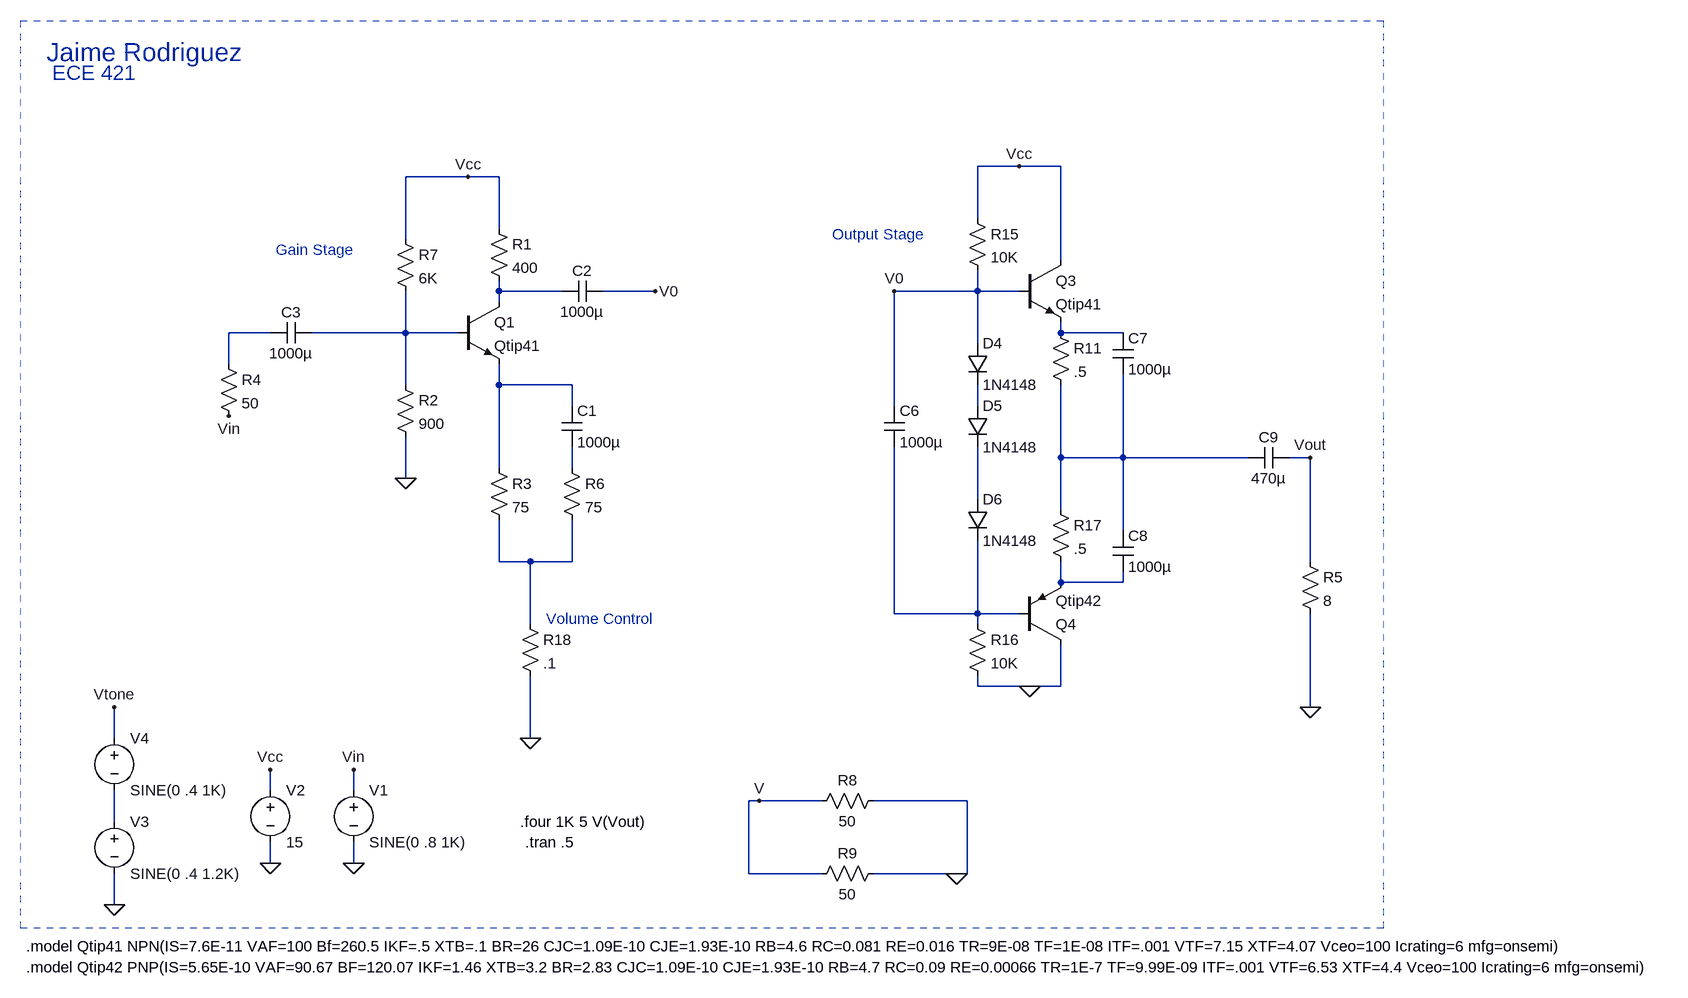
[diagram p0: schematic scrap copy.asc]
scrap copy.asc, the LTspice schematic file:
Version 4
SHEET 1 3016 1444
WIRE 1600 192 1536 192
WIRE 1664 192 1600 192
WIRE 752 208 656 208
WIRE 800 208 752 208
WIRE 1536 272 1536 192
WIRE 800 288 800 208
WIRE 656 304 656 208
WIRE 1664 336 1664 192
WIRE 800 384 800 368
WIRE 896 384 800 384
WIRE 1040 384 960 384
WIRE 1536 384 1536 352
WIRE 1536 384 1408 384
WIRE 1600 384 1536 384
WIRE 800 400 800 384
WIRE 448 448 384 448
WIRE 656 448 656 384
WIRE 656 448 512 448
WIRE 736 448 656 448
WIRE 1664 448 1664 432
WIRE 1760 448 1664 448
WIRE 1536 464 1536 384
WIRE 384 496 384 448
WIRE 656 528 656 448
WIRE 800 528 800 496
WIRE 912 528 800 528
WIRE 912 560 912 528
WIRE 1408 560 1408 384
WIRE 1536 560 1536 528
WIRE 1664 640 1664 528
WIRE 1760 640 1760 512
WIRE 1760 640 1664 640
WIRE 1952 640 1760 640
WIRE 2048 640 2016 640
WIRE 800 656 800 528
WIRE 912 656 912 624
WIRE 656 672 656 608
WIRE 1536 704 1536 624
WIRE 1664 720 1664 640
WIRE 1760 752 1760 640
WIRE 800 800 800 736
WIRE 848 800 800 800
WIRE 912 800 912 736
WIRE 912 800 848 800
WIRE 2048 800 2048 640
WIRE 1664 832 1664 800
WIRE 1760 832 1760 816
WIRE 1760 832 1664 832
WIRE 1408 880 1408 624
WIRE 1536 880 1536 768
WIRE 1536 880 1408 880
WIRE 1600 880 1536 880
WIRE 848 896 848 800
WIRE 1536 896 1536 880
WIRE 1536 992 1536 976
WIRE 1616 992 1536 992
WIRE 1664 992 1664 928
WIRE 1664 992 1616 992
WIRE 2048 1024 2048 880
WIRE 208 1072 208 1024
WIRE 848 1072 848 976
WIRE 448 1152 448 1120
WIRE 576 1152 576 1120
WIRE 1200 1168 1184 1168
WIRE 1296 1168 1200 1168
WIRE 1520 1168 1376 1168
WIRE 208 1200 208 1152
WIRE 448 1264 448 1232
WIRE 576 1264 576 1232
WIRE 1184 1280 1184 1168
WIRE 1296 1280 1184 1280
WIRE 1504 1280 1376 1280
WIRE 1520 1280 1520 1168
WIRE 1520 1280 1504 1280
WIRE 208 1328 208 1280
FLAG 576 1264 0
FLAG 448 1264 0
FLAG 448 1120 Vcc
FLAG 752 208 Vcc
FLAG 656 672 0
FLAG 1616 992 0
FLAG 1040 384 V0
FLAG 1408 384 V0
FLAG 2048 1024 0
FLAG 848 1072 0
FLAG 384 576 Vin
FLAG 576 1120 Vin
FLAG 208 1328 0
FLAG 208 1024 Vtone
FLAG 2048 640 Vout
FLAG 1504 1280 0
FLAG 1200 1168 V
FLAG 1600 192 Vcc
SYMBOL res 784 272 R0
SYMATTR InstName R1
SYMATTR Value 400
SYMBOL res 784 640 R0
SYMATTR InstName R3
SYMATTR Value 75
SYMBOL res 640 512 R0
SYMATTR InstName R2
SYMATTR Value 900
SYMBOL cap 896 560 R0
SYMATTR InstName C1
SYMATTR Value 1000µ
SYMBOL cap 960 368 R90
WINDOW 0 0 32 VBottom 2
WINDOW 3 32 32 VTop 2
SYMATTR InstName C2
SYMATTR Value 1000µ
SYMBOL cap 512 432 R90
WINDOW 0 0 32 VBottom 2
WINDOW 3 32 32 VTop 2
SYMATTR InstName C3
SYMATTR Value 1000µ
SYMBOL res 368 480 R0
SYMATTR InstName R4
SYMATTR Value 50
SYMBOL voltage 576 1136 R0
SYMATTR InstName V1
SYMATTR Value SINE(0 .8 1K)
SYMATTR Value2 AC 1
SYMBOL voltage 448 1136 R0
SYMATTR InstName V2
SYMATTR Value 15
SYMBOL res 640 288 R0
SYMATTR InstName R7
SYMATTR Value 6K
SYMBOL npn 736 400 R0
SYMATTR InstName Q1
SYMATTR Value Qtip41
SYMBOL res 896 640 R0
SYMATTR InstName R6
SYMATTR Value 75
SYMBOL npn 1600 336 R0
SYMATTR InstName Q3
SYMATTR Value Qtip41
SYMBOL pnp 1600 928 M180
SYMATTR InstName Q4
SYMATTR Value Qtip42
SYMBOL res 1648 432 R0
SYMATTR InstName R11
SYMATTR Value .5
SYMBOL res 1520 256 R0
SYMATTR InstName R15
SYMATTR Value 10K
SYMBOL res 1520 880 R0
SYMATTR InstName R16
SYMATTR Value 10K
SYMBOL res 1648 704 R0
SYMATTR InstName R17
SYMATTR Value .5
SYMBOL cap 1392 560 R0
SYMATTR InstName C6
SYMATTR Value 1000µ
SYMBOL cap 1744 448 R0
SYMATTR InstName C7
SYMATTR Value 1000µ
SYMBOL cap 1744 752 R0
SYMATTR InstName C8
SYMATTR Value 1000µ
SYMBOL cap 2016 624 R90
WINDOW 0 0 32 VBottom 2
WINDOW 3 32 32 VTop 2
SYMATTR InstName C9
SYMATTR Value 470µ
SYMBOL res 2032 784 R0
SYMATTR InstName R5
SYMATTR Value 8
SYMBOL res 832 880 R0
SYMATTR InstName R18
SYMATTR Value .1
SYMBOL diode 1520 464 R0
SYMATTR InstName D4
SYMATTR Value 1N4148
SYMBOL diode 1520 560 R0
SYMATTR InstName D5
SYMATTR Value 1N4148
SYMBOL diode 1520 704 R0
SYMATTR InstName D6
SYMATTR Value 1N4148
SYMBOL voltage 208 1184 R0
SYMATTR InstName V3
SYMATTR Value SINE(0 .4 1.2K)
SYMBOL voltage 208 1056 R0
SYMATTR InstName V4
SYMATTR Value SINE(0 .4 1K)
SYMBOL res 1392 1152 R90
WINDOW 0 0 56 VBottom 2
WINDOW 3 32 56 VTop 2
SYMATTR InstName R8
SYMATTR Value 50
SYMBOL res 1392 1264 R90
WINDOW 0 0 56 VBottom 2
WINDOW 3 32 56 VTop 2
SYMATTR InstName R9
SYMATTR Value 50
TEXT 840 1232 Left 2 !.tran .5
TEXT 72 1392 Left 2 !.model Qtip41 NPN(IS=7.6E-11 VAF=100 Bf=260.5 IKF=.5 XTB=.1 BR=26 CJC=1.09E-10 CJE=1.93E-10 RB=4.6 RC=0.081 RE=0.016 TR=9E-08 TF=1E-08 ITF=.001 VTF=7.15 XTF=4.07 Vceo=100 Icrating=6 mfg=onsemi)
TEXT 72 1424 Left 2 !.model Qtip42 PNP(IS=5.65E-10 VAF=90.67 BF=120.07 IKF=1.46 XTB=3.2 BR=2.83 CJC=1.09E-10 CJE=1.93E-10 RB=4.7 RC=0.09 RE=0.00066 TR=1E-7 TF=9.99E-09 ITF=.001 VTF=6.53 XTF=4.4 Vceo=100 Icrating=6 mfg=onsemi)
TEXT 104 16 Left 4 ;Jaime Rodriguez
TEXT 112 48 Left 3 ;ECE 421
TEXT 872 888 Left 2 ;Volume Control
TEXT 456 320 Left 2 ;Gain Stage
TEXT 1312 296 Left 2 ;Output Stage
TEXT 832 1200 Left 2 !.four 1K 5 V(Vout)
RECTANGLE Normal 64 -32 2160 1364 2

The netlist it stands for:
* scrap copy.asc
R1 Vcc N001 400
R3 N005 N010 75
R2 N003 0 900
C1 N005 N008 1000µ
C2 V0 N001 1000µ
C3 N003 N002 1000µ
R4 N002 Vin 50
V1 Vin 0 SINE(0 .8 1K) AC 1
V2 Vcc 0 15
R7 Vcc N003 6K
Q1 N001 N003 N005 0 Qtip41
R6 N008 N010 75
Q3 Vcc V0 N004 0 Qtip41
Q4 0 N012 N011 0 Qtip42
R11 N004 N007 .5
R15 Vcc V0 10K
R16 N012 0 10K
R17 N007 N011 .5
C6 V0 N012 1000µ
C7 N004 N007 1000µ
C8 N007 N011 1000µ
C9 Vout N007 470µ
R5 Vout 0 8
R18 N010 0 .1
D4 V0 N006 1N4148
D5 N006 N009 1N4148
D6 N009 N012 1N4148
V3 N013 0 SINE(0 .4 1.2K)
V4 Vtone N013 SINE(0 .4 1K)
R8 0 V 50
R9 0 V 50
.model D D
.lib standard.dio
.model NPN NPN
.model PNP PNP
.lib standard.bjt
.tran .5
.model Qtip41 NPN(IS=7.6E-11 VAF=100 Bf=260.5 IKF=.5 XTB=.1 BR=26 CJC=1.09E-10 CJE=1.93E-10 RB=4.6 RC=0.081 RE=0.016 TR=9E-08 TF=1E-08 ITF=.001 VTF=7.15 XTF=4.07 Vceo=100 Icrating=6 mfg=onsemi)
.model Qtip42 PNP(IS=5.65E-10 VAF=90.67 BF=120.07 IKF=1.46 XTB=3.2 BR=2.83 CJC=1.09E-10 CJE=1.93E-10 RB=4.7 RC=0.09 RE=0.00066 TR=1E-7 TF=9.99E-09 ITF=.001 VTF=6.53 XTF=4.4 Vceo=100 Icrating=6 mfg=onsemi)
* Jaime Rodriguez
* ECE 421
* Volume Control
* Gain Stage
* Output Stage
.four 1K 5 V(Vout)
.backanno
.end